# EAGLE schematic scout (EAGLE 7.6.0)
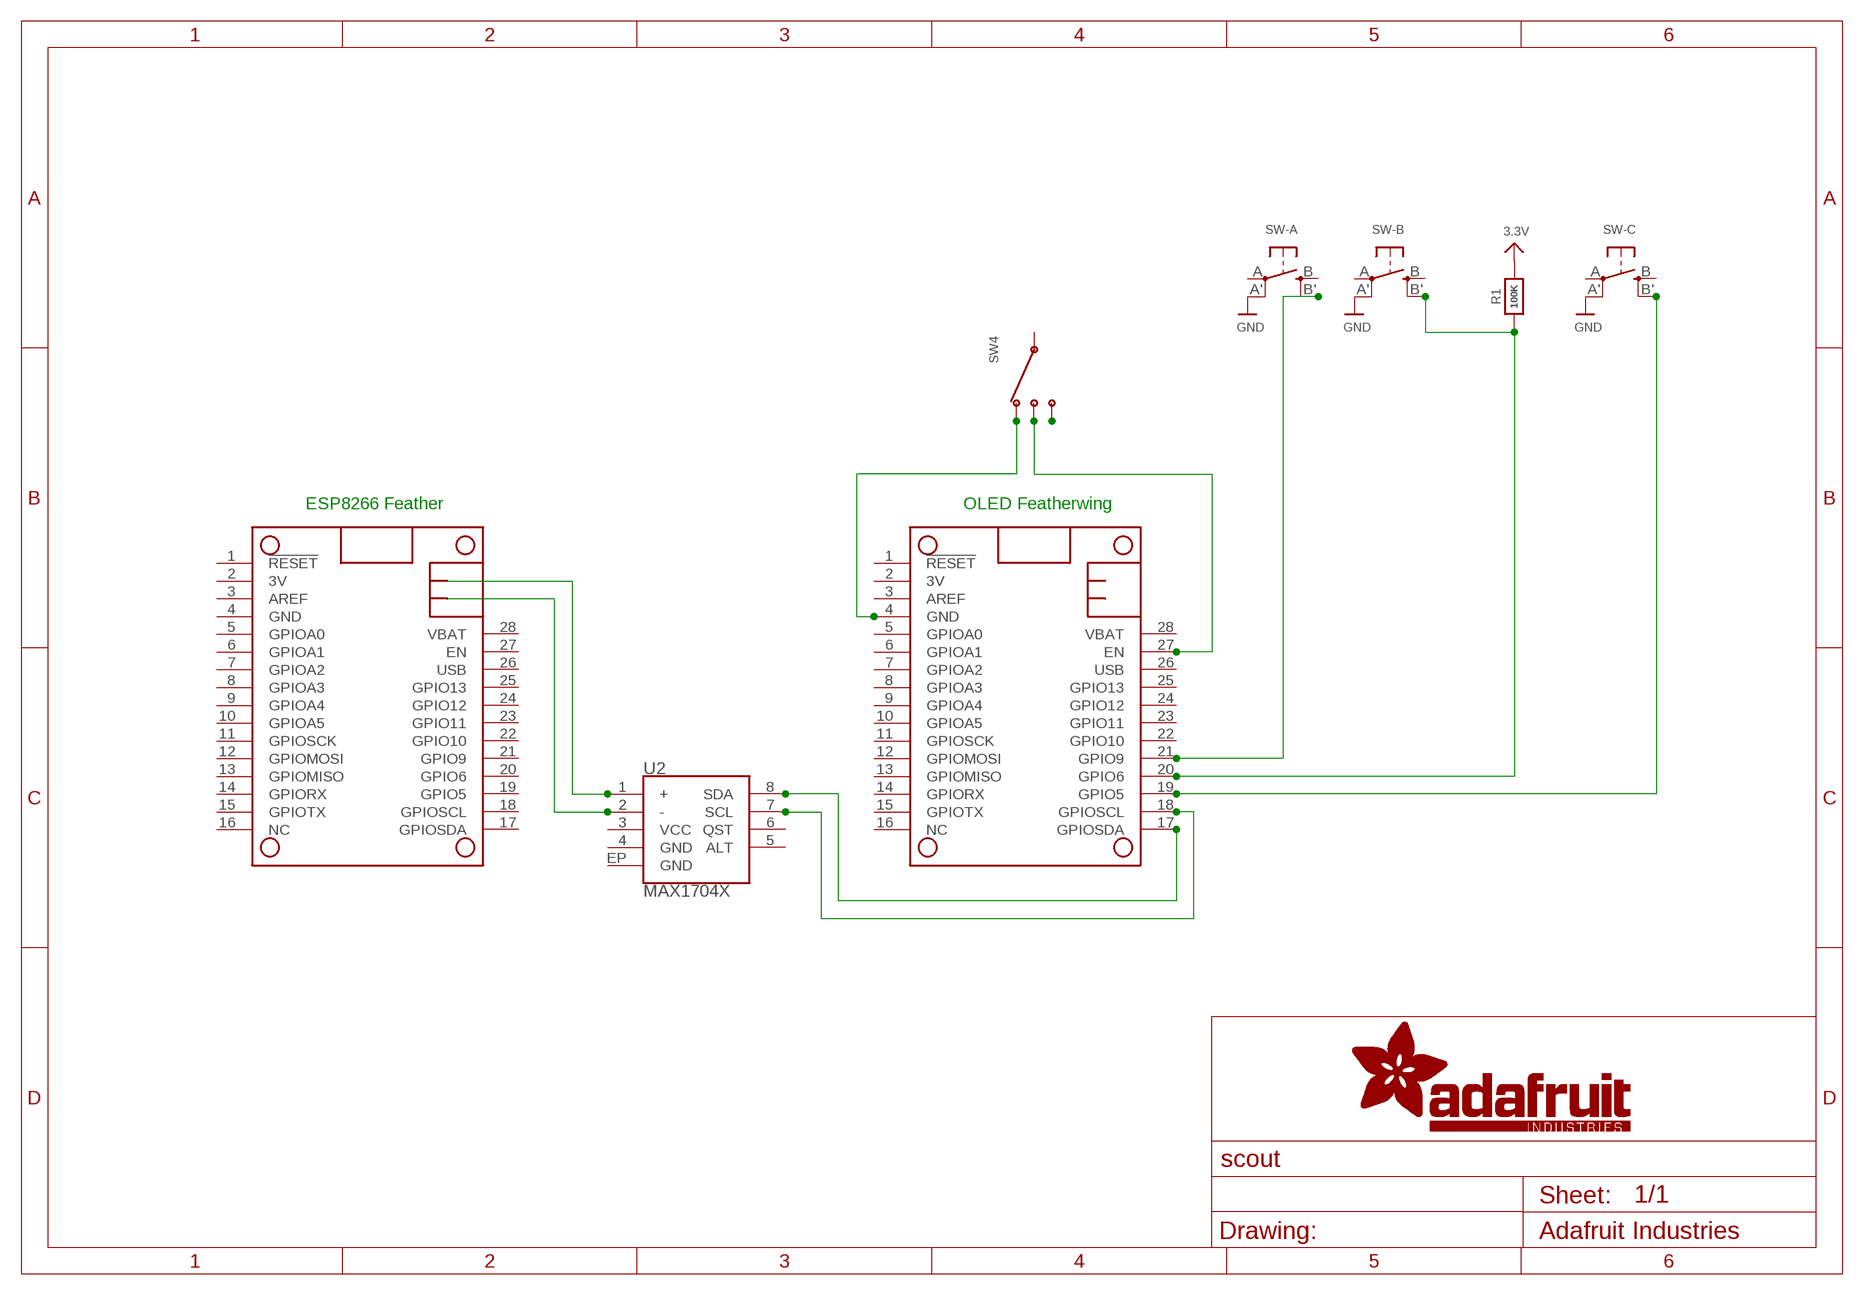
[diagram p0: schematic, sheet 1]

## Parts
MS1  MICROBUILDER_FEATHERWING_NODIM  [MICROBUILDER_FEATHERWING_DIM]
MS2  MICROBUILDER_FEATHERWING_NODIM  [MICROBUILDER_FEATHERWING_DIM]
R1  100K  MICROBUILDER_RESISTOR0603MINI  [MICROBUILDER_0603-MINI]
SW4  CSS-1310TB  [JSM07011]
SW-A  MICROBUILDER_SWITCH_TACT_SMTKMT0  [MICROBUILDER_BTN_KMT0]
SW-B  MICROBUILDER_SWITCH_TACT_SMTKMT0  [MICROBUILDER_BTN_KMT0]
SW-C  MICROBUILDER_SWITCH_TACT_SMTKMT0  [MICROBUILDER_BTN_KMT0]
U2  MAX1704X  SPARKFUN_MAX1704X  [SPARKFUN_TDFN-8]

## Nets
3.3V: R1.2
GND: SW-A.A'(P1) SW-B.A'(P1) SW-C.A'(P1)
N$1: MS1.21(GPIO9) SW-A.B'(S1)
N$2: MS1.20(GPIO6) R1.1 SW-B.B'(S1)
N$3: MS1.19(GPIO5) SW-C.B'(S1)
N$4: U2.1(+)
N$5: U2.2(-)
N$6: MS1.4(GND) SW4.4
N$7: MS1.27(EN) SW4.2
N$8: MS1.17(GPIOSDA) U2.8(SDA)
N$9: MS1.18(GPIOSCL) U2.7(SCL)
N$10: SW4.1
Unconnected: MS1.1(!RESET) MS1.2(3V) MS1.3(AREF) MS1.5(GPIOA0) MS1.6(GPIOA1) MS1.7(GPIOA2) MS1.8(GPIOA3) MS1.9(GPIOA4) MS1.10(GPIOA5) MS1.11(GPIOSCK) MS1.12(GPIOMOSI) MS1.13(GPIOMISO) MS1.14(GPIORX) MS1.15(GPIOTX) MS1.16(NC) MS1.22(GPIO10) MS1.23(GPIO11) MS1.24(GPIO12) MS1.25(GPIO13) MS1.26(USB) MS1.28(VBAT) MS2.1(!RESET) MS2.2(3V) MS2.3(AREF) MS2.5(GPIOA0) MS2.6(GPIOA1) MS2.7(GPIOA2) MS2.8(GPIOA3) MS2.9(GPIOA4) MS2.10(GPIOA5) MS2.11(GPIOSCK) MS2.12(GPIOMOSI) MS2.13(GPIOMISO) MS2.14(GPIORX) MS2.15(GPIOTX) MS2.16(NC) MS2.17(GPIOSDA) MS2.18(GPIOSCL) MS2.19(GPIO5) MS2.20(GPIO6) MS2.21(GPIO9) MS2.22(GPIO10) MS2.23(GPIO11) MS2.24(GPIO12) MS2.25(GPIO13) MS2.26(USB) MS2.27(EN) MS2.28(VBAT) SW4.3(C) SW-A.A(P) SW-A.B(S) SW-B.A(P) SW-B.B(S) SW-C.A(P) SW-C.B(S) U2.3(VCC) U2.4(GND) U2.5(ALT) U2.6(QST) U2.EP(GND)

## Notes on the sheet
- ESP8266 Feather | OLED Featherwing

## Power pins joined to a net without a drawn wire
GND: MS2.4(GND)

## Library data of the parts
MS1 MS2 = adafruit oled featherwing:MICROBUILDER_FEATHERWING
R1 = adafruit oled featherwing:MICROBUILDER_RESISTOR: Resistors For new designs, use the packages preceded by an '_' character since they are more reliable: The following footprints should be used on most boards: _0402 - Standard footprint for regular board layouts _0603 - Standard footprint for regular board layouts _0805 - Standard footprint for regular board layouts _1206 - Standard footprint for regular board layouts For extremely tight-pitch boards where space is at a premium, the following 'micro-pitch' footprints can be used (smaller pads, no silkscreen outline, etc.): _0402MP - Micro-pitch footprint for very dense/compact boards _0603MP - Micro-pitch footprint for very dense/compact boards _0805MP - Micro-pitch footprint for very dense/compact boards _1206MP - Micro-pitch footprint for very dense/compact boards
SW4 = switches:CSS-1310TB: Miniature Slide Switch; DIGIKEY: 563-1095-1-ND
SW-A SW-B SW-C = adafruit oled featherwing:MICROBUILDER_SWITCH_TACT_SMT: SMT Tact Switches 6x6mm - Digikey: P12940SCT-ND KMR2 (4.6x2.8mm) - Digikey: 401-1426-1-ND EVQ-PQHB55 - Light Touch, 160GF (4.5x4.5mm) - Digikey: P8090SCT-ND KMT0 - KMT021 NGJ LHS (etc.) IP68/Waterproof - Digikey: CKN10289CT-ND
U2 = lipo_fuel_gauge-v11:SPARKFUN_MAX1704X: MAX17043/MAX17044: Battery Fuel Guage (43 is 1cell, 44 is 2cell)

## Module LIPOFUELGAUGE
Ports: +(io) -(io) VCC(io) GND(io) ALT(io) SDA(io) SCL(io) QST(io)

### Library data of the parts